# Altium schematic sheet PowerSupply.SchDoc
size A; SheetNumber: 1; SheetTotal: 5
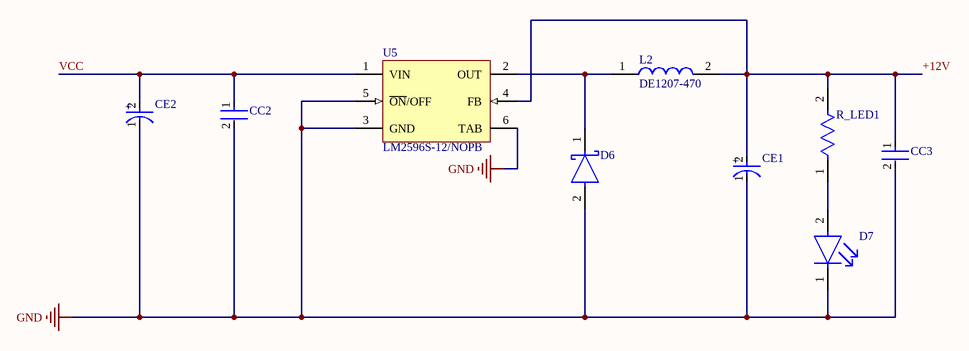
[diagram p0: PowerSupply.SchDoc]

## Parts
CC2  12062C104K4T2A  [FP-1206-L_3_2_0_2-W_1_6_0-IPC_A]  (value not drawn)
CC3  12062C104K4T2A  [FP-1206-L_3_2_0_2-W_1_6_0-IPC_A]  (value not drawn)
CE1  EEV-FK2A221M  [FP-FKK16-MFG]  (value not drawn)
CE2  50THV100M10X10.5  [FP-THV10X10_5-MFG]  (value not drawn)
D6  SS34-E3/57T  [FP-95402-MFG]  (value not drawn)
D7  SML-LX0603SIW-TR  [FP-SML-LX0603SIW-TR-MFG]  (value not drawn)
L2  DE1207-470  [DE1207330]
R_LED1  CRCW0805220RJNEA  [FP-CRCW0805-e3-IPC_A]  (value not drawn)
U5  LM2596S-12/NOPB  [KTT0005B_M]

## Nets
GND: CC2.2 CC3.2 CE1.1(C) CE2.1(C) D6.2(A) D7.1(C) U5.3(GND) U5.5(~{ON}/OFF) U5.6(TAB)
+12V: CC3.1 CE1.2(A) L2.2 R_LED1.2 U5.4(FB)
VCC: CC2.1 CE2.2(A) U5.1(VIN)
NetD6_1: D6.1(C) L2.1 U5.2(OUT)
NetD7_2: D7.2(A) R_LED1.1

## Notes on the sheet
- (in symbol CMP-05427-000076-1) +
- (in symbol CMP-35376-000015-1) +

## Library data of the parts
CC2 CC3 = CMP-04427-012685-1: Automotive Ceramic Capacitor, 1206, 100nF, 10%, X7R, 15%, 200V; Voltage Rating (DC): 200V; Case/Package: 1206; Length: 3.2mm; Max Operating Temperature: 125°C; Termination: SMD/SMT; Width: 1.6mm; Lead Free: Lead Free; Package Quantity: 2000; Min Operating Temperature: -55°C; Capacitance: 100nF; Height: 1.52mm; Depth: 1.6mm; Dielectric: X7R; Case Code (Metric): 3216; Packaging: Tape and Reel; Case Code (Imperial): 1206; Tolerance: 10%
CE1 = CMP-05427-000076-1: CAP ALUM 220UF 20% 100V SMD; Dielectric Material: Aluminium; Ripple Current (AC): 917mA; Life (Hours): 5000Hour; Leakage Current: 3uA; Impedance: 153mR; Height: 16.5mm; Min Operating Temperature: -55°C; Lead Free: Lead Free; Series: FK; Capacitance: 220uF; Construction: Cylindrical; Package Quantity: 1; Height - Seated (Max): 0.65inch; REACH SVHC: No SVHC; Diameter: 18mm; Tolerance: 20%; Voltage Rating (DC): 100V; Mount: Surface Mount; Termination: SMD/SMT; Case/Package: Radial; Voltage Rating: 100V; Ripple Current: 917mA; Packaging: Tape and Reel; Max Operating Temperature: 105°C; Voltage: 100V; RoHS Compliant: Yes; Length: 17mm; Width: 1.2mm; ESR (Equivalent Series Resistance): 153mR; Contact Plating: Tin; Radiation Hardening: No; Number of Pins: 2
CE2 = CMP-35376-000015-1: CAP ALUM 100UF 20% 50V SMD; Ripple Current: 175mA; Ripple Current (AC): 350mA; ESR (Equivalent Series Resistance): 250mR; Life (Hours): 3000Hour; Max Operating Temperature: 125°C; Height: 10.5mm; Package Quantity: 1; Radiation Hardening: No; Diameter: 10mm; Capacitance: 100uF; Case/Package: Radial; RoHS Compliant: Yes; Voltage: 50V; REACH SVHC: No SVHC; Packaging: Cut Tape; Height - Seated (Max): 0.413inch; Voltage Rating: 50V; Min Operating Temperature: -40°C; Mount: Surface Mount; Termination: SMD/SMT; Series: THV; Construction: Cylindrical; Voltage Rating (DC): 50V; Tolerance: 20%
D6 = CMP-02539-000012-1: DIODE SCHOTTKY 40V 3A DO214AB; Manufacturer: Vishay; Max Junction Temp: +150°C; Peak Reverse Current: 0.5mA; Max Surge Forward Current: 100A; Standoff Height: 0mm; ComponentLink2Description: Datasheet; Device Class L3: Schottky Diodes; Height: 2.62mm; Max Repetitive Reverse Voltage: 40V; Lead Free: Yes; Package: 95402; Temperature Range High: +150°C; ComponentLink2URL: http://www.vishay.com/docs/88751/ss32.pdf; Temperature: -55°C to +150°C; Footprint Url: http://www.vishay.com/docs/95402/smc.pdf; Automotive: No; Forward Current: 3A; Category: Diode; Manufacturer Part Number: SS34-E3/57T; RoHS: TRUE; Device Class L2: Diodes; Mouser Description: Schottky Diodes & Rectifiers 3.0 Amp 40 Volt; Octopart: https://octopart.com/ss34-e3%2F57t-vishay-39552907; Temperature Range Low: -55°C; Device Class L1: Discrete Semiconductors; Digikey Description: DIODE SCHOTTKY 40V 3A DO214AB
D7 = CMP-57192-000009-1: LED RED DIFFUSED SMD; Test Current: 20mA; Forward Voltage: 2V; Approvals: UL; Dominant Wavelength: 636nm; Viewing Angle: 140°; Lens Color: White; Luminous Intensity: 60mcd; Power Rating: 50mW; Number of LEDs: 1; Color: Red; Forward Current: 20mA; Moisture Sensitivity Level: 2; Case Code (Imperial): 0603; Lead Free: Lead Free; Lens Transparency: Diffused; Case Code (Metric): 1608; Height: 0.6mm; Max Operating Temperature: 85°C; Width: 0.8mm; Lens Style: Diffused; Illumination Color: Red; Wavelength: 636nm; REACH SVHC: No SVHC; Package Quantity: 1; RoHS Compliant: Yes; Case/Package: 0603; Number of Pins: 2; Packaging: Tape and Reel; Length: 1.6mm; Mount: Surface Mount; Min Operating Temperature: -25°C
L2 = DE1207-330: Inductor; Manufacturer_Name: FERROCORE; Datasheet Link: https://www.tme.eu/Document/d1f8b47d020ebf11f3b92c6891638dfa/de.pdf; Height: 8mm; Manufacturer_Part_Number: DE1207-330
R_LED1 = CMP-2001-03683-2: RES Thick Film, 220Ω, 5%, 0.125W, 200ppm/°C, 0805; Voltage Rating: 150V; Power Rating: 125mW; Resistance: 220R; Case Code (Metric): 2012; Height: 0.45mm; Radiation Hardening: No; Contact Plating: Tin; Voltage Rating (DC): 150V; Packaging: Tape and Reel; Lead Free: Lead Free; Military Standard: Not; Temperature Coefficient: 200ppm/°C; Width: 1.25mm; Case Code (Imperial): 0805; Termination: SMD/SMT; Tolerance: 5%; Depth: 1.25mm; Package Quantity: 5000; Weight: 0.000194oz; Length: 2mm; Min Operating Temperature: -55°C; Composition: Thick Film; Case/Package: 0805; Max Operating Temperature: 155°C
U5 = CMP-0069-00273-3: SIMPLE SWITCHER® Power Converter 150 KHz 3A Step-Down Voltage Regulator, 5-pin TO-263, Pb-Free; Manufacturer: Texas Instruments; PowerWise: N; PackageTopMarking: NSUZXYTTE#*LM2596S*-12 P+; PinCount: 5; ComponentLink1Description: Datasheet URL; PackageDescription: TO-263, Molded, .400 x .390 x .180in, 5 Lead, .067in Pitch, Surface Mount; Code_JEDEC: MO-169-AB; RoHS: Y; PackageReference: KTT0005B; ComponentLink1URL: http://www.ti.com/general/docs/lit/getliterature.tsp?genericPartNumber=LM2596&fileType=pdf; CompType: Switcher